# Altium project VESC_MotorController.PrjPcb
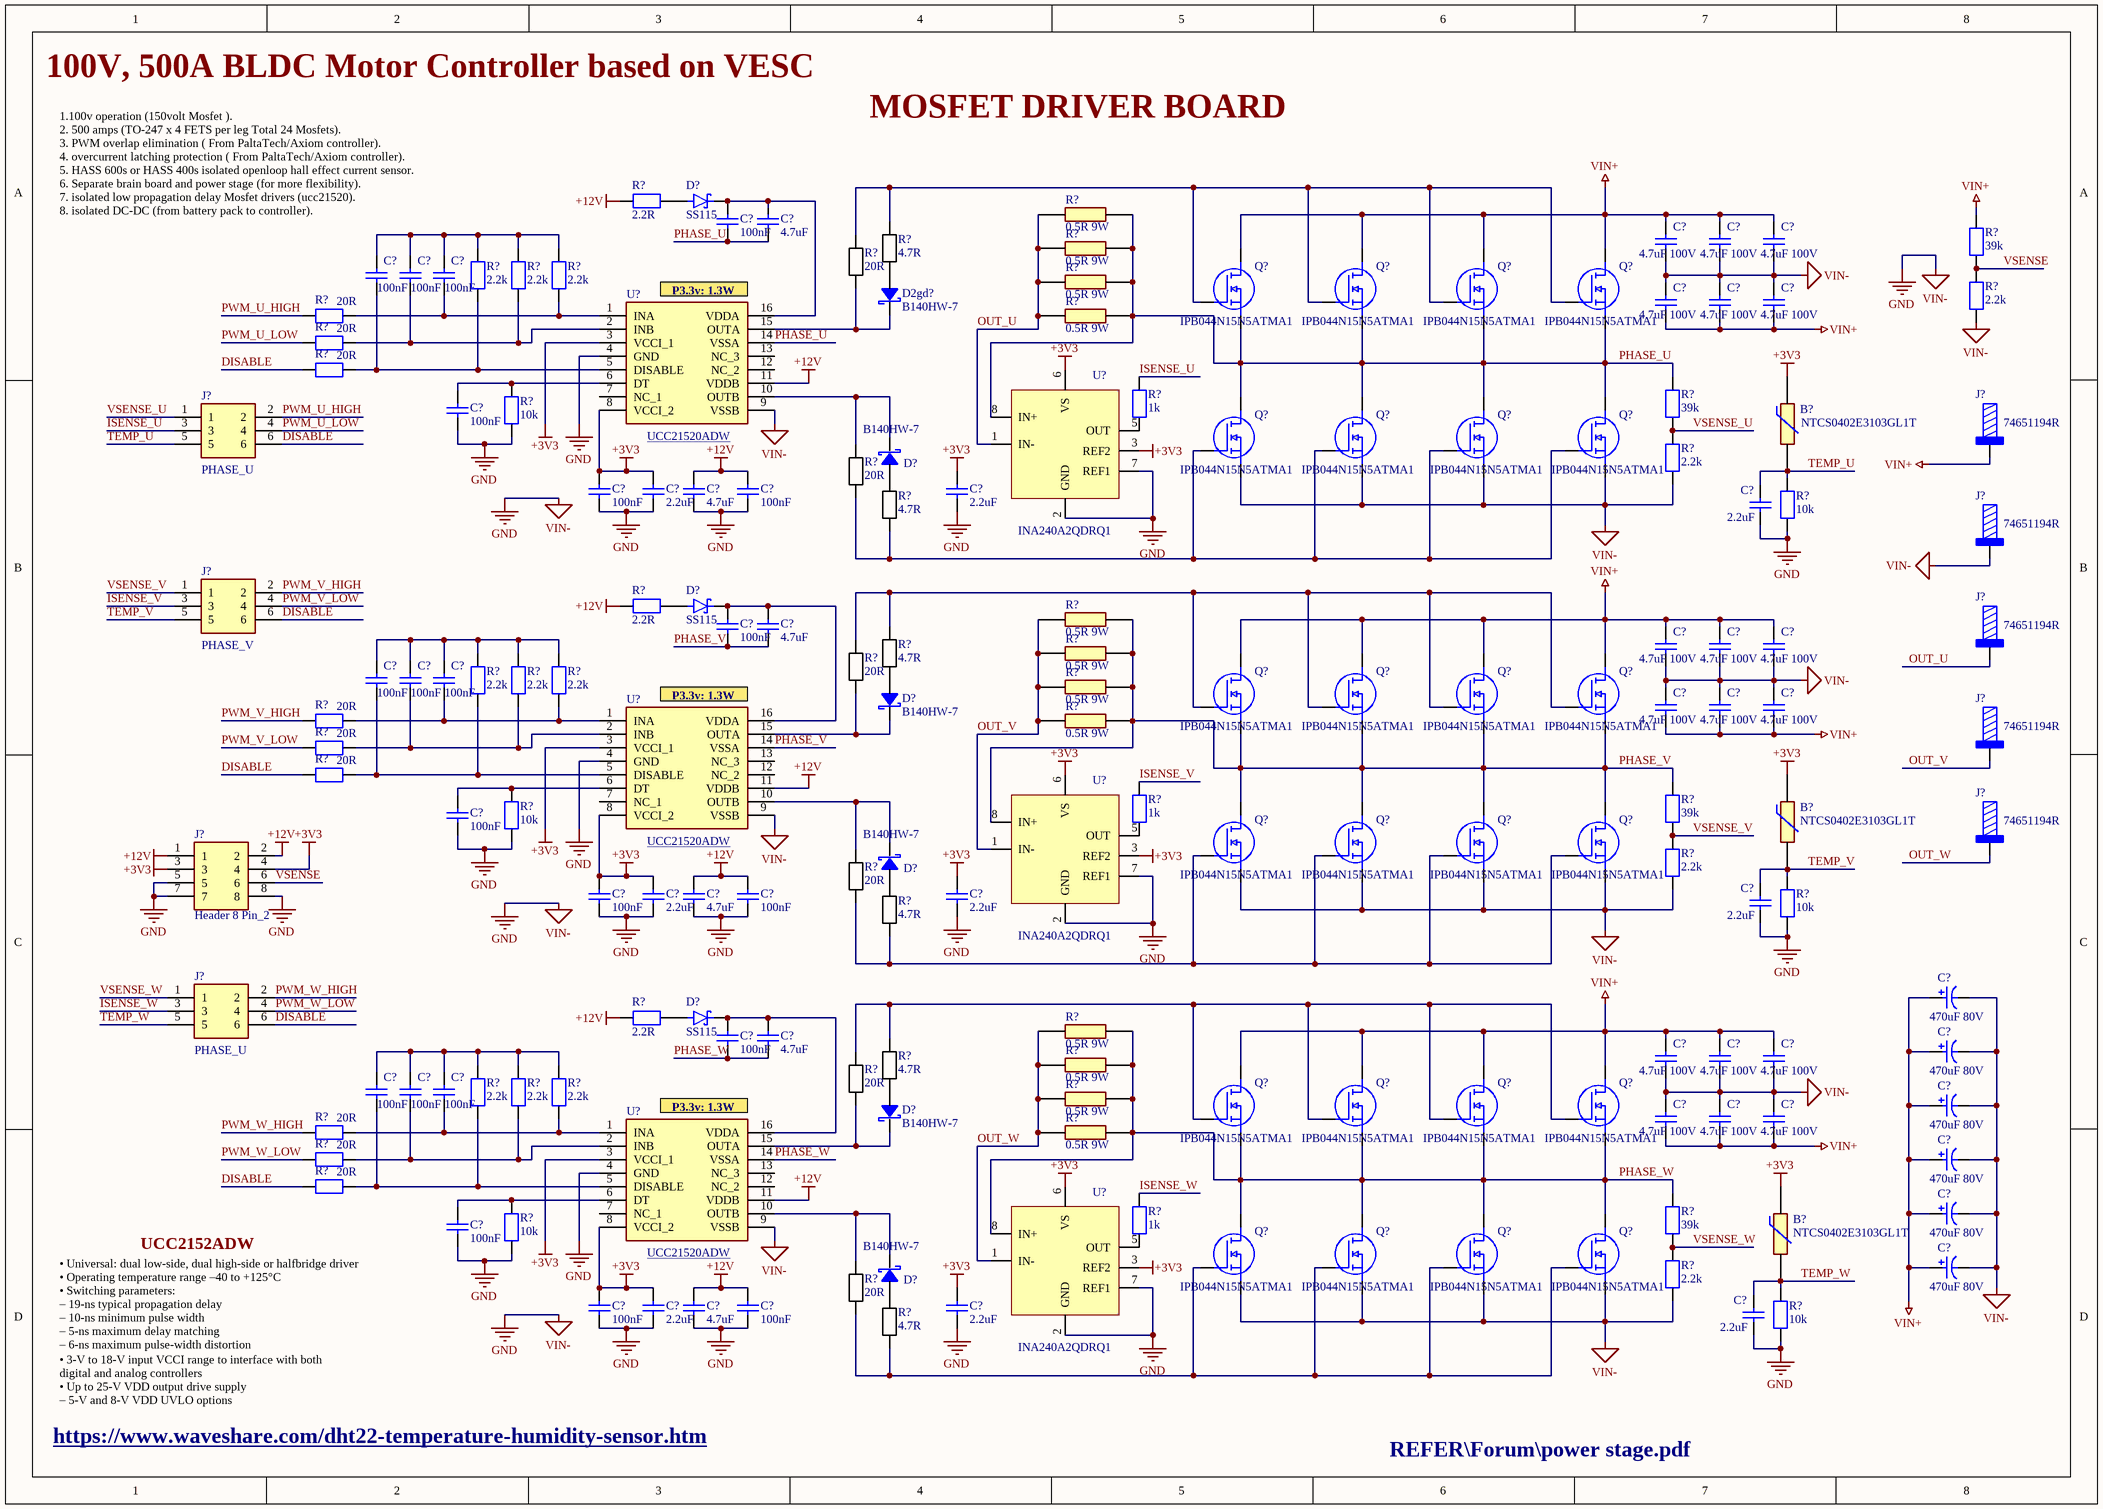
[diagram p0: PowerBoard.SchDoc]
2 sheets, 249 parts. Net scope: global (net labels, ports and power ports of the same name join across sheets).
Board files: Controller.PcbDoc, PowerBoard.PcbDoc
Sheets:
  PowerBoard.SchDoc
  Controller.SchDoc

## Sheet PowerBoard.SchDoc: DriveHUB CardFrame - Backplane Power
size A3; Date: 01/08/22; Engineer: AJC; DocumentNumber: 35-735; Revision: D; SheetNumber: 1; SheetTotal: 3; Manager: AJC

### Parts
(Parts that share a designator on the sheet are numbered #1, #2 ... from top to bottom, then left to right.)
B1  NTCS0402E3103GL1T  [THRMC1005X65N]
B2  NTCS0402E3103GL1T  [THRMC1005X65N]
B3  NTCS0402E3103GL1T  [THRMC1005X65N]
C?#1  100nF  [C0402]
C?#2  4.7uF  [C0603]
C?#3  4.7uF 100V  [CAPC6153X300N]
C?#4  4.7uF 100V  [CAPC6153X300N]
C?#5  4.7uF 100V  [CAPC6153X300N]
C?#6  100nF  [C0402]
C?#7  100nF  [C0402]
C?#8  100nF  [C0402]
C?#9  4.7uF 100V  [CAPC6153X300N]
C?#10  4.7uF 100V  [CAPC6153X300N]
C?#11  4.7uF 100V  [CAPC6153X300N]
C?#12  100nF  [C0402]
C?#13  100nF  [C0402]
C?#14  2.2uF  [C0603]
C?#15  4.7uF  [C0603]
C?#16  100nF  [C0402]
C?#17  2.2uF  [C0603]
C?#18  2.2uF  [C0603]
C?#19  100nF  [C0402]
C?#20  4.7uF  [C0603]
C?#21  4.7uF 100V  [CAPC6153X300N]
C?#22  4.7uF 100V  [CAPC6153X300N]
C?#23  4.7uF 100V  [CAPC6153X300N]
C?#24  100nF  [C0402]
C?#25  100nF  [C0402]
C?#26  100nF  [C0402]
C?#27  4.7uF 100V  [CAPC6153X300N]
C?#28  4.7uF 100V  [CAPC6153X300N]
C?#29  4.7uF 100V  [CAPC6153X300N]
C?#30  100nF  [C0402]
C?#31  100nF  [C0402]
C?#32  2.2uF  [C0603]
C?#33  4.7uF  [C0603]
C?#34  100nF  [C0402]
C?#35  2.2uF  [C0603]
C?#36  2.2uF  [C0603]
C?#37  470uF 80V  [CAPPRD500W80D1250H3200]
C?#38  100nF  [C0402]
C?#39  4.7uF  [C0603]
C?#40  470uF 80V  [CAPPRD500W80D1250H3200]
C?#41  4.7uF 100V  [CAPC6153X300N]
C?#42  4.7uF 100V  [CAPC6153X300N]
C?#43  4.7uF 100V  [CAPC6153X300N]
C?#44  100nF  [C0402]
C?#45  100nF  [C0402]
C?#46  100nF  [C0402]
C?#47  470uF 80V  [CAPPRD500W80D1250H3200]
C?#48  4.7uF 100V  [CAPC6153X300N]
C?#49  4.7uF 100V  [CAPC6153X300N]
C?#50  4.7uF 100V  [CAPC6153X300N]
C?#51  470uF 80V  [CAPPRD500W80D1250H3200]
C?#52  470uF 80V  [CAPPRD500W80D1250H3200]
C?#53  100nF  [C0402]
C?#54  470uF 80V  [CAPPRD500W80D1250H3200]
C?#55  100nF  [C0402]
C?#56  2.2uF  [C0603]
C?#57  4.7uF  [C0603]
C?#58  100nF  [C0402]
C?#59  2.2uF  [C0603]
C?#60  2.2uF  [C0603]
D2gd?  B140HW-7  [SOD123]
D?#1  SS115  [DIOM4325X250N]
D?#2  B140HW-7  [SOD123]
D?#3  SS115  [DIOM4325X250N]
D?#4  B140HW-7  [SOD123]
D?#5  B140HW-7  [SOD123]
D?#6  SS115  [DIOM4325X250N]
D?#7  B140HW-7  [SOD123]
D?#8  B140HW-7  [SOD123]
J?#1  74651194R  [74651194]
J?#2  PHASE_U  [61300621121]
J?#3  74651194R  [74651194]
J?#4  PHASE_V  [61300621121]
J?#5  74651194R  [74651194]
J?#6  74651194R  [74651194]
J?#7  74651194R  [74651194]
J?#8  Header 8 Pin_2  [61300821121]
J?#9  PHASE_U  [61300621121]
Q?#1  IPB044N15N5ATMA1  [IPB044N15N5ATMA1]
Q?#2  IPB044N15N5ATMA1  [IPB044N15N5ATMA1]
Q?#3  IPB044N15N5ATMA1  [IPB044N15N5ATMA1]
Q?#4  IPB044N15N5ATMA1  [IPB044N15N5ATMA1]
Q?#5  IPB044N15N5ATMA1  [IPB044N15N5ATMA1]
Q?#6  IPB044N15N5ATMA1  [IPB044N15N5ATMA1]
Q?#7  IPB044N15N5ATMA1  [IPB044N15N5ATMA1]
Q?#8  IPB044N15N5ATMA1  [IPB044N15N5ATMA1]
Q?#9  IPB044N15N5ATMA1  [IPB044N15N5ATMA1]
Q?#10  IPB044N15N5ATMA1  [IPB044N15N5ATMA1]
Q?#11  IPB044N15N5ATMA1  [IPB044N15N5ATMA1]
Q?#12  IPB044N15N5ATMA1  [IPB044N15N5ATMA1]
Q?#13  IPB044N15N5ATMA1  [IPB044N15N5ATMA1]
Q?#14  IPB044N15N5ATMA1  [IPB044N15N5ATMA1]
Q?#15  IPB044N15N5ATMA1  [IPB044N15N5ATMA1]
Q?#16  IPB044N15N5ATMA1  [IPB044N15N5ATMA1]
Q?#17  IPB044N15N5ATMA1  [IPB044N15N5ATMA1]
Q?#18  IPB044N15N5ATMA1  [IPB044N15N5ATMA1]
Q?#19  IPB044N15N5ATMA1  [IPB044N15N5ATMA1]
Q?#20  IPB044N15N5ATMA1  [IPB044N15N5ATMA1]
Q?#21  IPB044N15N5ATMA1  [IPB044N15N5ATMA1]
Q?#22  IPB044N15N5ATMA1  [IPB044N15N5ATMA1]
Q?#23  IPB044N15N5ATMA1  [IPB044N15N5ATMA1]
Q?#24  IPB044N15N5ATMA1  [IPB044N15N5ATMA1]
R3  0.5R 9W  [RESC10052X137N]
R6  0.5R 9W  [RESC10052X137N]
R11  0.5R 9W  [RESC10052X137N]
R14  0.5R 9W  [RESC10052X137N]
R26  0.5R 9W  [RESC10052X137N]
R28  0.5R 9W  [RESC10052X137N]
R33  0.5R 9W  [RESC10052X137N]
R35  0.5R 9W  [RESC10052X137N]
R47  0.5R 9W  [RESC10052X137N]
R49  0.5R 9W  [RESC10052X137N]
R54  0.5R 9W  [RESC10052X137N]
R56  0.5R 9W  [RESC10052X137N]
R?#1  2.2R  [R1206]
R?#2  4.7R  [R1206]
R?#3  20R  [R1206]
R?#4  39k  [R0805]
R?#5  2.2k  [R0603]
R?#6  2.2k  [R0603]
R?#7  2.2k  [R0603]
R?#8  2.2k  [R0805]
R?#9  20R  [R1206]
R?#10  20R  [R1206]
R?#11  20R  [R1206]
R?#12  1k  [R0603]
R?#13  39k  [R0805]
R?#14  10k  [R0603]
R?#15  20R  [R1206]
R?#16  2.2k  [R0805]
R?#17  4.7R  [R1206]
R?#18  10k  [R0603]
R?#19  2.2R  [R1206]
R?#20  4.7R  [R1206]
R?#21  20R  [R1206]
R?#22  2.2k  [R0603]
R?#23  2.2k  [R0603]
R?#24  2.2k  [R0603]
R?#25  20R  [R1206]
R?#26  20R  [R1206]
R?#27  20R  [R1206]
R?#28  1k  [R0603]
R?#29  39k  [R0805]
R?#30  10k  [R0603]
R?#31  20R  [R1206]
R?#32  2.2k  [R0805]
R?#33  4.7R  [R1206]
R?#34  10k  [R0603]
R?#35  2.2R  [R1206]
R?#36  4.7R  [R1206]
R?#37  20R  [R1206]
R?#38  2.2k  [R0603]
R?#39  2.2k  [R0603]
R?#40  2.2k  [R0603]
R?#41  20R  [R1206]
R?#42  20R  [R1206]
R?#43  20R  [R1206]
R?#44  1k  [R0603]
R?#45  39k  [R0805]
R?#46  10k  [R0603]
R?#47  20R  [R1206]
R?#48  2.2k  [R0805]
R?#49  4.7R  [R1206]
R?#50  10k  [R0603]
U?#1  UCC21520ADW  [SOIC127P1030X265-16N]
U?#2  INA240A2QDRQ1  [SOIC127P600X175-8N]
U?#3  UCC21520ADW  [SOIC127P1030X265-16N]
U?#4  INA240A2QDRQ1  [SOIC127P600X175-8N]
U?#5  UCC21520ADW  [SOIC127P1030X265-16N]
U?#6  INA240A2QDRQ1  [SOIC127P600X175-8N]

### Nets
+3V3: B1.1 B2.1 B3.1 C?#13.2 C?#14.2 C?#17.2 C?#31.2 C?#32.2 C?#35.2 C?#55.2 C?#56.2 C?#59.2 J?#8.3 J?#8.4 U?#1.3(VCCI_1) U?#1.8(VCCI_2) U?#2.3(REF2) U?#2.6(VS) U?#3.3(VCCI_1) U?#3.8(VCCI_2) U?#4.3(REF2) U?#4.6(VS) U?#5.3(VCCI_1) U?#5.8(VCCI_2) U?#6.3(REF2) U?#6.6(VS)
+12V: C?#15.2 C?#16.2 C?#33.2 C?#34.2 C?#57.2 C?#58.2 J?#8.1 J?#8.2 R?#1.1 R?#19.1 R?#35.1 U?#1.11(VDDB) U?#3.11(VDDB) U?#5.11(VDDB)
GND: C?#3.1 C?#4.1 C?#5.1 C?#9.2 C?#10.2 C?#11.2 C?#12.1 C?#13.1 C?#14.1 C?#15.1 C?#16.1 C?#17.1 C?#18.1 C?#21.1 C?#22.1 C?#23.1 C?#27.2 C?#28.2 C?#29.2 C?#30.1 C?#31.1 C?#32.1 C?#33.1 C?#34.1 C?#35.1 C?#36.1 C?#37.2 C?#40.2 C?#41.1 C?#42.1 C?#43.1 C?#47.2 C?#48.2 C?#49.2 C?#50.2 C?#51.2 C?#52.2 C?#53.1 C?#54.2 C?#55.1 C?#56.1 C?#57.1 C?#58.1 C?#59.1 C?#60.1 J?#3.1 J?#8.5 J?#8.7 J?#8.8 Q?#5.SOURCE Q?#6.SOURCE Q?#7.SOURCE Q?#8.SOURCE Q?#13.SOURCE Q?#14.SOURCE Q?#15.SOURCE Q?#16.SOURCE Q?#21.SOURCE Q?#22.SOURCE Q?#23.SOURCE Q?#24.SOURCE R?#8.1 R?#14.1 R?#16.1 R?#18.1 R?#30.1 R?#32.1 R?#34.1 R?#46.1 R?#48.1 R?#50.1 U?#1.4(GND) U?#1.9(VSSB) U?#2.2(GND) U?#2.7(REF1) U?#3.4(GND) U?#3.9(VSSB) U?#4.2(GND) U?#4.7(REF1) U?#5.4(GND) U?#5.9(VSSB) U?#6.2(GND) U?#6.7(REF1)  [also labelled VIN-]
VIN+: C?#3.2 C?#4.2 C?#5.2 C?#9.1 C?#10.1 C?#11.1 C?#21.2 C?#22.2 C?#23.2 C?#27.1 C?#28.1 C?#29.1 C?#37.1 C?#40.1 C?#41.2 C?#42.2 C?#43.2 C?#47.1 C?#48.1 C?#49.1 C?#50.1 C?#51.1 C?#52.1 C?#54.1 J?#1.1 Q?#1.DRAIN Q?#2.DRAIN Q?#3.DRAIN Q?#4.DRAIN Q?#9.DRAIN Q?#10.DRAIN Q?#11.DRAIN Q?#12.DRAIN Q?#17.DRAIN Q?#18.DRAIN Q?#19.DRAIN Q?#20.DRAIN R?#4.2
DISABLE: J?#2.6 J?#4.6 J?#9.6 R?#11.1 R?#27.1 R?#43.1
ISENSE_U: J?#2.3 R?#12.2
ISENSE_V: J?#4.3 R?#28.2
ISENSE_W: J?#9.3 R?#44.2
OUT_U: J?#5.1 R3.1 R6.1 R11.1 R14.1 U?#2.1(IN-)
OUT_V: J?#6.1 R26.1 R28.1 R33.1 R35.1 U?#4.1(IN-)
OUT_W: J?#7.1 R47.1 R49.1 R54.1 R56.1 U?#6.1(IN-)
PHASE_U: C?#1.1 C?#2.1 Q?#1.SOURCE Q?#2.SOURCE Q?#3.SOURCE Q?#4.SOURCE Q?#5.DRAIN Q?#6.DRAIN Q?#7.DRAIN Q?#8.DRAIN R3.2 R6.2 R11.2 R14.2 R?#13.2 U?#1.14(VSSA) U?#2.8(IN+)
PHASE_V: C?#19.1 C?#20.1 Q?#9.SOURCE Q?#10.SOURCE Q?#11.SOURCE Q?#12.SOURCE Q?#13.DRAIN Q?#14.DRAIN Q?#15.DRAIN Q?#16.DRAIN R26.2 R28.2 R33.2 R35.2 R?#29.2 U?#3.14(VSSA) U?#4.8(IN+)
PHASE_W: C?#38.1 C?#39.1 Q?#17.SOURCE Q?#18.SOURCE Q?#19.SOURCE Q?#20.SOURCE Q?#21.DRAIN Q?#22.DRAIN Q?#23.DRAIN Q?#24.DRAIN R47.2 R49.2 R54.2 R56.2 R?#45.2 U?#5.14(VSSA) U?#6.8(IN+)
PWM_U_HIGH: J?#2.2 R?#9.1
PWM_U_LOW: J?#2.4 R?#10.1
PWM_V_HIGH: J?#4.2 R?#25.1
PWM_V_LOW: J?#4.4 R?#26.1
PWM_W_HIGH: J?#9.2 R?#41.1
PWM_W_LOW: J?#9.4 R?#42.1
TEMP_U: B1.2 C?#18.2 J?#2.5 R?#18.2
TEMP_V: B2.2 C?#36.2 J?#4.5 R?#34.2
TEMP_W: B3.2 C?#60.2 J?#9.5 R?#50.2
VSENSE: J?#8.6 R?#4.1 R?#8.2
VSENSE_U: J?#2.1 R?#13.1 R?#16.2
VSENSE_V: J?#4.1 R?#29.1 R?#32.2
VSENSE_W: J?#9.1 R?#45.1 R?#48.2
NetC?#1_2: C?#1.2 C?#2.2 D?#1.C(K) U?#1.16(VDDA)
NetC?#6_1: C?#6.1 R?#5.1 R?#11.2 U?#1.5(DISABLE)
NetC?#6_2: C?#6.2 C?#7.2 C?#8.2 R?#5.2 R?#6.2 R?#7.2
NetC?#7_1: C?#7.1 R?#6.1 R?#10.2 U?#1.2(INB)
NetC?#8_1: C?#8.1 R?#7.1 R?#9.2 U?#1.1(INA)
NetC?#12_2: C?#12.2 R?#14.2 U?#1.6(DT)
NetC?#19_2: C?#19.2 C?#20.2 D?#3.C(K) U?#3.16(VDDA)
NetC?#24_1: C?#24.1 R?#22.1 R?#27.2 U?#3.5(DISABLE)
NetC?#24_2: C?#24.2 C?#25.2 C?#26.2 R?#22.2 R?#23.2 R?#24.2
NetC?#25_1: C?#25.1 R?#23.1 R?#26.2 U?#3.2(INB)
NetC?#26_1: C?#26.1 R?#24.1 R?#25.2 U?#3.1(INA)
NetC?#30_2: C?#30.2 R?#30.2 U?#3.6(DT)
NetC?#38_2: C?#38.2 C?#39.2 D?#6.C(K) U?#5.16(VDDA)
NetC?#44_1: C?#44.1 R?#38.1 R?#43.2 U?#5.5(DISABLE)
NetC?#44_2: C?#44.2 C?#45.2 C?#46.2 R?#38.2 R?#39.2 R?#40.2
NetC?#45_1: C?#45.1 R?#39.1 R?#42.2 U?#5.2(INB)
NetC?#46_1: C?#46.1 R?#40.1 R?#41.2 U?#5.1(INA)
NetC?#53_2: C?#53.2 R?#46.2 U?#5.6(DT)
NetD2gd?_A: D2gd?.A R?#2.1
NetD2gd?_C: D2gd?.C R?#3.1 U?#1.15(OUTA)
NetD?#1_A: D?#1.A R?#1.2
NetD?#2_A: D?#2.A R?#17.2
NetD?#2_C: D?#2.C R?#15.2 U?#1.10(OUTB)
NetD?#3_A: D?#3.A R?#19.2
NetD?#4_A: D?#4.A R?#20.1
NetD?#4_C: D?#4.C R?#21.1 U?#3.15(OUTA)
NetD?#5_A: D?#5.A R?#33.2
NetD?#5_C: D?#5.C R?#31.2 U?#3.10(OUTB)
NetD?#6_A: D?#6.A R?#35.2
NetD?#7_A: D?#7.A R?#36.1
NetD?#7_C: D?#7.C R?#37.1 U?#5.15(OUTA)
NetD?#8_A: D?#8.A R?#49.2
NetD?#8_C: D?#8.C R?#47.2 U?#5.10(OUTB)
NetQ?#1_GATE: Q?#1.GATE Q?#2.GATE Q?#3.GATE Q?#4.GATE R?#2.2 R?#3.2
NetQ?#5_GATE: Q?#5.GATE Q?#6.GATE Q?#7.GATE Q?#8.GATE R?#15.1 R?#17.1
NetQ?#9_GATE: Q?#9.GATE Q?#10.GATE Q?#11.GATE Q?#12.GATE R?#20.2 R?#21.2
NetQ?#13_GATE: Q?#13.GATE Q?#14.GATE Q?#15.GATE Q?#16.GATE R?#31.1 R?#33.1
NetQ?#17_GATE: Q?#17.GATE Q?#18.GATE Q?#19.GATE Q?#20.GATE R?#36.2 R?#37.2
NetQ?#21_GATE: Q?#21.GATE Q?#22.GATE Q?#23.GATE Q?#24.GATE R?#47.1 R?#49.1
NetR?#12_1: R?#12.1 U?#2.5(OUT)
NetR?#28_1: R?#28.1 U?#4.5(OUT)
NetR?#44_1: R?#44.1 U?#6.5(OUT)

Not connected (* = marked no-connect by the designer): U?#1 7(NC_1) 12(NC_2) 13(NC_3); U?#3 7(NC_1) 12(NC_2) 13(NC_3); U?#5 7(NC_1) 12(NC_2) 13(NC_3)

### Notes on the sheet
- 100V, 500A BLDC Motor Controller based on VESC
- MOSFET DRIVER BOARD
- 1.100v operation (150volt Mosfet ).
  2. 500 amps (TO-247 x 4 FETS per leg Total 24 Mosfets).
  3. PWM overlap elimination ( From PaltaTech/Axiom controller).
  4. overcurrent latching protection ( From PaltaTech/Axiom controller).
  5. HASS 600s or HASS 400s isolated openloop hall effect current sensor.
  6. Separate brain board and power stage (for more flexibility).
  7. isolated low propagation delay Mosfet drivers (ucc21520).
  8. isolated DC-DC (from battery pack to controller).
- (near U?#1) P3.3v: 1.3W
- (near U?#3) P3.3v: 1.3W
- (near U?#5) P3.3v: 1.3W
- UCC2152ADW
- • Universal: dual low-side, dual high-side or halfbridge driver
  • Operating temperature range –40 to +125°C
  • Switching parameters:
  – 19-ns typical propagation delay
  – 10-ns minimum pulse width
  – 5-ns maximum delay matching
  – 6-ns maximum pulse-width distortion
- https://www.waveshare.com/dht22-temperature-humidity-sensor.htm
- • 3-V to 18-V input VCCI range to interface with both
  digital and analog controllers
  • Up to 25-V VDD output drive supply
  – 5-V and 8-V VDD UVLO options
- REFER\Forum\power stage.pdf

### Library data of the parts
B1-B3 = NTCS0402E3103GL1T: NTC Thermistors 10Kohms 2% AEC-Q200; Manufacturer: Vishay; Supplier Part Number: 594-NTCS402E3103GL1T; Supplier: Mouser; Manufacturer Part Number: NTCS0402E3103GL1T; Price: 0.47; Value: NTCS0402E3103GL1T
C?#1 C?#6-C?#8 C?#12 C?#13 C?#16 C?#19 C?#24-C?#26 C?#30 C?#31 C?#34 C?#38 C?#44-C?#46 C?#53 C?#55 C?#58 = 100nF ± 10% 50V: Manufacturer: Yageo; Manufacturer Part Number: CS0603KRX7R9BB104; Value: 100nF; Supplier: mouser; Supplier Part Number: 603-CS0603KRX79BB104; Price: 0.1
C?#2 C?#15 C?#20 C?#33 C?#39 C?#57 = 4.7uF ± 10% 50V: Manufacturer: Yageo; Manufacturer Part Number: GRM188R61H225ME11J; Value: 4.7uF; Supplier: mouser; Supplier Part Number: 81-GRM188R61H225ME1J; Price: 0.3
C?#3-C?#5 C?#9-C?#11 C?#21-C?#23 C?#27-C?#29 C?#41-C?#43 C?#48-C?#50 = 4.7uF ± 10% 100V: Capacitor KRM55 L=6.1mm W=5.3mm T=2.8mm; Manufacturer: Murata Electronics; Manufacturer Part Number: KRM55LR72A475KH01K; Supplier Part Number: 81-KRM55LR72A475KH1K; Supplier: Mouser; Price: 3.2; Value: 4.7uF 100V
C?#14 C?#17 C?#18 C?#32 C?#35 C?#36 C?#56 C?#59 C?#60 = 2.2uF ± 10% 50V: Manufacturer: Yageo; Manufacturer Part Number: GRM188R61H225ME11J; Value: 2.2uF; Supplier: mouser; Supplier Part Number: 81-GRM188R61H225ME1J; Price: 0.3
C?#37 C?#40 C?#47 C?#51 C?#52 C?#54 = 470uF 80V 2200mA: Aluminum Electrolytic Capacitors - Radial Leaded 80VDC 470uF 2200mA Polar; Manufacturer: Panasonic; Manufacturer Part Number: EEU-FS1K471L; Supplier Part Number: 667-EEU-FS1K471L; Supplier: Mouser; Value: 470uF 80V; Price: 2
D2gd? D?#2 D?#4 D?#5 D?#7 D?#8 = B140HW-7: Schottky Diodes & Rectifiers 1A, 40V; Value: B140HW-7; Manufacturer Part Number: B140HW-7; Manufacturer: Diodes; Supplier: Mouser; Supplier Part Number: 621-B140HW-7; Price: 0.42
D?#1 D?#3 D?#6 = SS115: Schottky Diodes & Rectifiers 1A, 150V, Schottky Rectifier; Manufacturer: Taiwan Semiconductor; Value: 1A, 150V; Price: 0.34; Supplier: Mouser; Manufacturer Part Number: SS115; Supplier Part Number: 821-SS115
J?#1 J?#3 J?#5-J?#7 = 74651194R: WP-THRSH REDCUBE THR with external thread, M4 x 5mm, 85A; Manufacturer: Wurth Elektronik; Surface: Tin; ComponentLink1Description: Website Link; ComponentLink1URL: https://www.we-online.com/redexpert/article/74651194R?ad; ComponentLink2Description: Datasheet Link; ComponentLink2URL: https://www.we-online.com/redexpert/spec/74651194R?ad; Manufacturer Part Number: 74651194R; Category: REDCUBE THR; Match Code: WP-THRSH; Mount: Through Hole Reflow; Operating Temperature Max: 150°C; Operating Temperature Min: -55°C; Packaging: Tape and Reel; Length: 10mm; Width: 10mm; Height: 8.5mm; Material: Brass; Number of Pins: 9; Rated Current: 85A; Thread Length: 5mm; Thread Size: M4; Supplier: Mouser; Supplier Part Number: 710-74651195R; Price: 3.5; Value: 74651194R
J?#2 J?#4 J?#9 = Header 6 Pin_2: WR-PHD 2.54mm  Dual Pin Header THT 06p Wurth Elektronik WR-PHD Series, Series Number 6130, 2.54mm Pitch 6 Way 2 Row Straight PCB Header, Solder Termination; Value: 61300621121; Supplier Part Number: 710-61300621121; Supplier: Mouser; Manufacturer: Wurth Elektronik; Manufacturer Part Number: 61300621121; Price: 0.57
J?#8 = Header 8 Pin_2: Headers & Wire Housings WR-PHD 2.54mm Hdr 8P Dual Str Gold; Manufacturer: Wurth Elektronik; Value: 61300821121; Supplier Part Number: 710-61300621121; Supplier: Mouser; Manufacturer Part Number: 61300821121; Price: 0.7
Q?#1-Q?#24 = IPB044N15N5ATMA1: INFINEON - IPB044N15N5ATMA1 - Power MOSFET, N Channel, 150 V, 174 A, 0.0034 ohm, TO-263 (D2PAK), Surface Mount; Supplier Part Number: 726-IPB044N15N5ATMA1; Supplier: Mouser; Manufacturer: Infineon; Manufacturer Part Number: IPB044N15N5ATMA1; Price: 12.76; Value: IPB044N15N5ATMA1
R3 R6 R11 R14 R26 R28 R33 R35 R47 R49 R54 R56 = CSS2H-3920R-L500FE: Current Sense Resistors - SMD 0.5mOHMS 9W 1% AEC-Q200; Manufacturer: Bourns; Value: 0.5ohm 9W; Value: 2.2R; Supplier: Mouser; Supplier Part Number: 603-RC1206FR-072R2L; Price: 0.12
R?#1 R?#19 R?#35 = 2.2ohm 0.25W ±1%: 2.2 ohm 0.25W ±1%; Manufacturer Part Number: RC1206FR-072R2L; Manufacturer: Yageo; Supplier Part Number: 652-CSS2H3920RL500FE; Supplier: Mouser; Manufacturer Part Number: CSS2H-3920R-L500FE; Price: 2
R?#2 R?#17 R?#20 R?#33 R?#36 R?#49 = 4.7 ohm 0.25W ±1%: Manufacturer Part Number: RC1206FR-074R7L; Manufacturer: Yageo; Value: 4.7R; Supplier: Mouser; Supplier Part Number: 603-RC1206FR-074R7L; Price: 0.12
R?#3 R?#15 R?#21 R?#31 R?#37 R?#47 = 20 ohm 0.25W ±1%: Manufacturer Part Number: RC1206FR-0720RL; Manufacturer: Yageo; Value: 20R; Supplier: Mouser; Supplier Part Number: 603-RC1206FR-0720RL; Price: 0.12
R?#4 R?#13 R?#29 R?#45 = 39 kOhms ±1% 0.8W: Manufacturer: Yageo; Manufacturer Part Number: RT0805FRE0739KL; Value: 39k; Supplier: mouser; Supplier Part Number: 603-RT0805FRE0739KL; Price: 0.1
R?#5-R?#7 R?#22-R?#24 R?#38-R?#40 = 2.2 kOhms ±1% 0.1W: Manufacturer: Yageo; Manufacturer Part Number: RC0603FR-072K2L; Value: 2.2k; Supplier: Mouser; Supplier Part Number: 603-RC0603FR-072K2L; Price: 0.1
R?#8 R?#16 R?#32 R?#48 = 2.2 kOhms ±1% 0.8W: Manufacturer: Yageo; Manufacturer Part Number: RT0805FRE072K2L; Value: 2.2k; Supplier: mouser; Supplier Part Number: 603-RT0805FRE072K2L; Price: 0.1
R?#9-R?#11 R?#25-R?#27 R?#41-R?#43 = 20ohm 0.25W ±1%: 20 ohm 0.25W ±1%; Manufacturer Part Number: RC1206FR-0720RL; Manufacturer: Yageo; Value: 20R; Supplier: Mouser; Supplier Part Number: 603-RC1206FR-0720RL; Price: 0.12
R?#12 R?#28 R?#44 = 1 kOhms ±1% 0.1W: Manufacturer: Yageo; Manufacturer Part Number: RC0603FR-071KL; Value: 1k; Supplier: Mouser; Supplier Part Number: 603-RC0603FR-071KL; Price: 0.1
R?#14 R?#18 R?#30 R?#34 R?#46 R?#50 = 10 kOhms ±1% 0.1W: Manufacturer: Yageo; Manufacturer Part Number: RC0603FR-0710KL; Value: 10k; Supplier: mouser; Supplier Part Number: 603-RC0603FR-0710KL; Price: 0.1
U?#1 U?#3 U?#5 = UCC21520ADW: 4A/6A, 5.7 kVrms Isolated Dual Channel Gate Driver; Manufacturer: Texas Instruments; Supplier Part Number: 595-UCC21520ADW; Value: UCC21520ADW; Manufacturer Part Number: UCC21520ADW; Price: 7.6; Supplier: Mouser
U?#2 U?#4 U?#6 = INA240A2QDRQ1: Automotive, High/Low Side, Bi-Directional Zer-Drift Current Sense Amp w/ Enhanced PWM Rejection; Manufacturer: Texas Instruments; Supplier Part Number: 595-INA240A2QDRQ1; Supplier: Mouser; Manufacturer Part Number: INA240A2QDRQ1; Price: 3.8; Value: INA240A2QDRQ1

## Sheet Controller.SchDoc
size A3
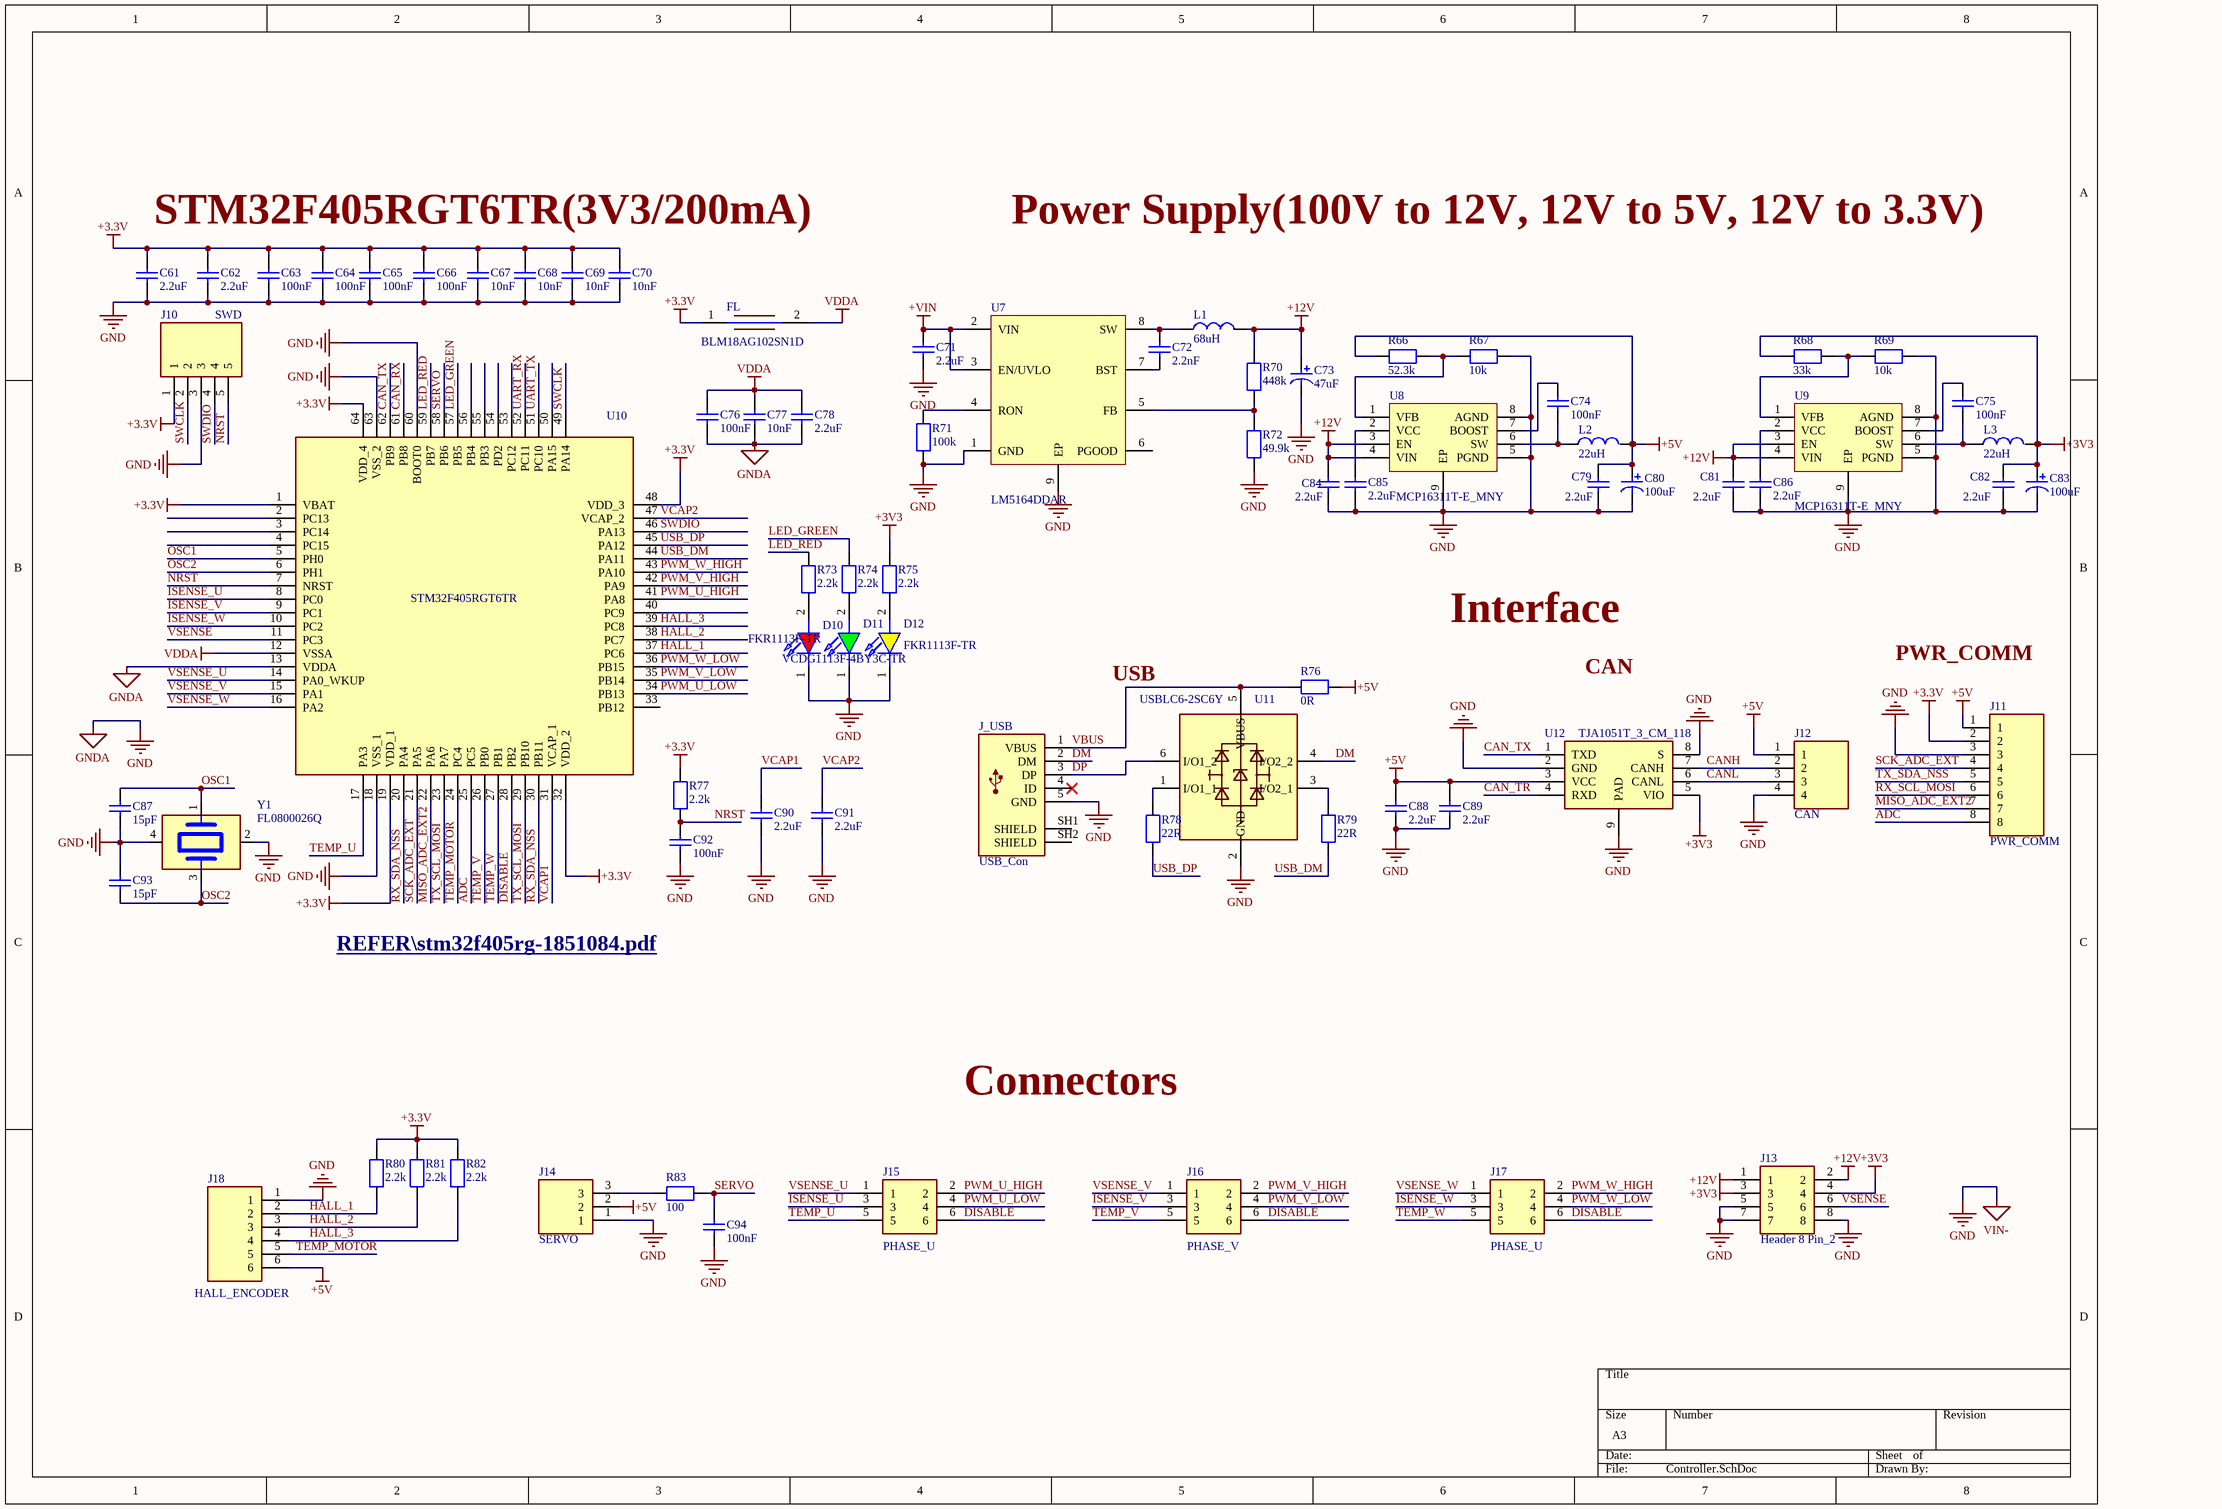
[diagram p1: Controller.SchDoc]

### Parts
C61  2.2uF  [C0603]
C62  2.2uF  [C0603]
C63  100nF  [C0402]
C64  100nF  [C0402]
C65  100nF  [C0402]
C66  100nF  [C0402]
C67  10nF  [C0402]
C68  10nF  [C0402]
C69  10nF  [C0402]
C70  10nF  [C0402]
C71  2.2uF  [C0603]
C72  2.2nF  [C0402]
C73  47uF  [CAPPRD200W52D500H1250]
C74  100nF  [C0402]
C75  100nF  [C0402]
C76  100nF  [C0402]
C77  10nF  [C0402]
C78  2.2uF  [C0603]
C79  2.2uF  [C0603]
C80  100uF  [CAPPRD225W50D680H1250]
C81  2.2uF  [C0603]
C82  2.2uF  [C0603]
C83  100uF  [CAPPRD225W50D680H1250]
C84  2.2uF  [C0603]
C85  2.2uF  [C0603]
C86  2.2uF  [C0603]
C87  15pF  [C0402]
C88  2.2uF  [C0603]
C89  2.2uF  [C0603]
C90  2.2uF  [C0603]
C91  2.2uF  [C0603]
C92  100nF  [C0402]
C93  15pF  [C0402]
C94  100nF  [C0402]
D10  FKR1113F-TR  [VCDG1113F4BY3CTR]
D11  VCDG1113F-4BY3C-TR  [VCDG1113F4BY3CTR]
D12  FKR1113F-TR  [VCDG1113F4BY3CTR]
FL  BLM18AG102SN1D  [BLM18EG121SH1D]
J10  SWD  [61300511121]
J11  PWR_COMM  [61301821121]
J12  CAN  [61300411121]
J13  Header 8 Pin_2  [61300821121]
J14  SERVO  [61300311121]
J15  PHASE_U  [61300621121]
J16  PHASE_V  [61300621121]
J17  PHASE_U  [61300621121]
J18  HALL_ENCODER  [61300611121]
J_USB  USB_Con  [10118194-0001LF]
L1  68uH  [INDPM7973X540N]
L2  22uH  [INDPM7973X540N]
L3  22uH  [INDPM7973X540N]
R66  52.3k  [R0603]
R67  10k  [R0603]
R68  33k  [R0603]
R69  10k  [R0603]
R70  448k  [R0603]
R71  100k  [R0603]
R72  49.9k  [R0603]
R73  2.2k  [R0603]
R74  2.2k  [R0603]
R75  2.2k  [R0603]
R76  0R  [R1206]
R77  2.2k  [R0603]
R78  22R  [R0603]
R79  22R  [R0603]
R80  2.2k  [R0603]
R81  2.2k  [R0603]
R82  2.2k  [R0603]
R83  100  [R0603]
U7  LM5164DDAR  [SOIC-8(EPAD)]
U8  MCP16311T-E_MNY  [MSOP-8]
U9  MCP16311T-E_MNY  [MSOP-8]
U10  STM32F405RGT6TR  [QFP50P1200X1200X160-64N]
U11  USBLC6-2SC6Y  [SOT95P280X145-6N]
U12  TJA1051T_3_CM_118  [SOIC127P600X175-8N]
Y1  FL0800026Q  [XTAL_FL0800026Q]

### Nets
+3.3V: C61.2 C62.2 C63.2 C64.2 C65.2 C66.2 C67.2 C68.2 C69.2 C70.2 FL.1 J10.1 J11.2 R77.2 R80.2 R81.2 R82.2 U10.1(VBAT) U10.19(VDD_1) U10.32(VDD_2) U10.48(VDD_3) U10.64(VDD_4)
+3V3: C82.2 C83.1 J13.3 J13.4 L3.2 R68.1 R75.2 U12.5(VIO)
+5V: C79.2 C80.1 C88.2 C89.2 J11.1 J12.1 J14.2 J18.6 L2.2 R66.1 R76.2 U12.3(VCC)
+12V: C73.1 C81.2 C84.2 J13.1 J13.2 L1.2 R70.2 U8.3(EN) U8.4(VIN) U9.3(EN) U9.4(VIN)
+VIN: C71.2 U7.2(VIN) U7.3(EN/UVLO)
GND: C61.1 C62.1 C63.1 C64.1 C65.1 C66.1 C67.1 C68.1 C69.1 C70.1 C71.1 C73.2 C76.1 C77.1 C78.1 C79.1 C80.2 C81.1 C82.1 C83.2 C84.1 C85.1 C86.1 C87.1 C88.1 C89.1 C90.1 C91.1 C92.1 C93.2 C94.1 D10.1(K) D11.1(K) D12.1(K) J10.3 J11.3 J12.4 J13.5 J13.7 J13.8 J14.1 J18.1 J_USB.5(GND) R67.2 R69.2 R71.1 R72.1 U7.1(GND) U7.9(EP) U8.5(PGND) U8.8(AGND) U8.9(EP) U9.5(PGND) U9.8(AGND) U9.9(EP) U10.13(VDDA) U10.18(VSS_1) U10.60(BOOT0) U10.63(VSS_2) U11.2(GND) U12.2(GND) U12.8(S) U12.9(PAD) Y1.2(GND) Y1.4(GND)  [also labelled GNDA, VIN-]
VDDA: C76.2 C77.2 C78.2 FL.2 U10.12(VSSA)
ADC: J11.8 U10.25(PC5)
CAN_RX: U10.61(PB8)
CAN_TR: U12.4(RXD)
CAN_TX: U10.62(PB9) U12.1(TXD)
CANH: J12.2 U12.7(CANH)
CANL: J12.3 U12.6(CANL)
DISABLE: J15.6 J16.6 J17.6 U10.28(PB2)
DM: J_USB.2(DM) U11.4(I/O2_2)
DP: J_USB.3(DP) U11.6(I/O1_2)
HALL_1: J18.2 R80.1 U10.37(PC6)
HALL_2: J18.3 R81.1 U10.38(PC7)
HALL_3: J18.4 R82.1 U10.39(PC8)
ISENSE_U: J15.3 U10.8(PC0)
ISENSE_V: J16.3 U10.9(PC1)
ISENSE_W: J17.3 U10.10(PC2)
LED_GREEN: R74.2 U10.57(PB5)
LED_RED: R73.2 U10.59(PB7)
MISO_ADC_EXT2: J11.7 U10.22(PA6)
NRST: C92.2 J10.5 R77.1 U10.7(NRST)
OSC1: C87.2 U10.5(PH0) Y1.1
OSC2: C93.1 U10.6(PH1) Y1.3
PWM_U_HIGH: J15.2 U10.41(PA8)
PWM_U_LOW: J15.4 U10.34(PB13)
PWM_V_HIGH: J16.2 U10.42(PA9)
PWM_V_LOW: J16.4 U10.35(PB14)
PWM_W_HIGH: J17.2 U10.43(PA10)
PWM_W_LOW: J17.4 U10.36(PB15)
RX_SCL_MOSI: J11.6
RX_SDA_NSS: U10.20(PA4) U10.30(PB11)
SCK_ADC_EXT: J11.4 U10.21(PA5)
SERVO: C94.2 R83.2 U10.58(PB6)
SWCLK: J10.2 U10.49(PA14)
SWDIO: J10.4 U10.46(PA13)
TEMP_MOTOR: J18.5 U10.24(PC4)
TEMP_U: J15.5 U10.17(PA3)
TEMP_V: J16.5 U10.26(PB0)
TEMP_W: J17.5 U10.27(PB1)
TX_SCL_MOSI: U10.23(PA7) U10.29(PB10)
TX_SDA_NSS: J11.5
UART_RX: U10.52(PC11)
UART_TX: U10.51(PC10)
USB_DM: R79.1 U10.44(PA11)
USB_DP: R78.1 U10.45(PA12)
VBUS: J_USB.1(VBUS) R76.1 U11.5(VBUS)
VCAP1: C90.2 U10.31(VCAP_1)
VCAP2: C91.2 U10.47(VCAP_2)
VSENSE: J13.6 U10.11(PC3)
VSENSE_U: J15.1 U10.14(PA0_WKUP)
VSENSE_V: J16.1 U10.15(PA1)
VSENSE_W: J17.1 U10.16(PA2)
NetC72_1: C72.1 U7.7(BST)
NetC72_2: C72.2 L1.1 U7.8(SW)
NetC74_1: C74.1 L2.1 U8.6(SW)
NetC74_2: C74.2 U8.7(BOOST)
NetC75_1: C75.1 L3.1 U9.6(SW)
NetC75_2: C75.2 U9.7(BOOST)
NetC85_2: C85.2 U8.2(VCC)
NetC86_2: C86.2 U9.2(VCC)
NetD10_2: D10.2(A) R73.1
NetD11_2: D11.2(A) R74.1
NetD12_2: D12.2(A) R75.1
NetJ14_3: J14.3 R83.1
NetR66_2: R66.2 R67.1 U8.1(VFB)
NetR68_2: R68.2 R69.1 U9.1(VFB)
NetR70_1: R70.1 R72.2 U7.5(FB)
NetR71_2: R71.2 U7.4(RON)
NetR78_2: R78.2 U11.1(I/O1_1)
NetR79_2: R79.2 U11.3(I/O2_1)

Not connected (* = marked no-connect by the designer): J_USB 4(ID)* SH1(SHIELD) SH2(SHIELD); U7 6(PGOOD); U10 2(PC13) 3(PC14) 4(PC15) 33(PB12) 40(PC9) 50(PA15) 53(PC12) 54(PD2) 55(PB3) 56(PB4)

### Notes on the sheet
- STM32F405RGT6TR(3V3/200mA)
- Power Supply(100V to 12V, 12V to 5V, 12V to 3.3V)
- Interface
- (near U11) USB
- CAN
- PWR_COMM
- REFER\stm32f405rg-1851084.pdf <F:\TASK\2023\8\VESC_MotorController\REFER\STM32f405rg-1851084.pdf>
- Connectors

### Library data of the parts
C61 C62 C71 C78 C79 C81 C82 C84-C86 C88-C91 = 2.2uF ± 10% 50V: as C?#14 on sheet PowerBoard; Value: 2.2uF; Supplier: mouser; Supplier Part Number: 81-GRM188R61H225ME1J; Price: 0.3
C63-C66 C74-C76 C92 C94 = 100nF ± 10% 50V: as C?#1 on sheet PowerBoard; Value: 100nF; Supplier: mouser; Supplier Part Number: 603-CS0603KRX79BB104; Price: 0.1
C67-C70 C77 = 10nF ± 10% 50V: Manufacturer: Yageo; Manufacturer Part Number: CS0603KRX79BB103; Value: 10nF; Supplier: mouser; Supplier Part Number: 603-CS0603KRX79BB103; Price: 0.1
C72 = 2.2nF ± 10% 50V: Manufacturer: Yageo; Manufacturer Part Number: CS0603KRX79BB222; Value: 2.2nF; Supplier: mouser; Supplier Part Number: 603-CS0603KRX79BB222; Price: 0.1
C73 = 47uF ± 10% 25V: Manufacturer: Wurth Electronic; Manufacturer Part Number: 860040472001; Value: 47uF; Supplier: mouser; Supplier Part Number: 710-860040472001; Price: 0.18
C80 C83 = 100uF ± 10% 25V: Manufacturer: Lelon; Manufacturer Part Number: RGA101M1EBK-0611G; Value: 100uF; Supplier: mouser; Supplier Part Number: 140-RGA101M1EBK0611G; Price: 0.17
C87 C93 = 15pF ± 10% 50V: Manufacturer: Yageo; Manufacturer Part Number: CS0603KRX79BB150; Value: 15pF; Supplier: mouser; Supplier Part Number: 603-CS0603KRX79BB150; Price: 0.1
D10 = LED_RED: R/A LED; Manufacturer: Stanley Electric; Value: Red; Supplier Part Number: 327-FKR1113FTR; Supplier: Mouser; Manufacturer Part Number: FKR1113F-TR; Price: 0.78
D11 = LED_GREEN: R/A LED; Manufacturer: Stanley Electric; Value: Green; Supplier Part Number: 327-VCDG1113F4BY3CTR; Supplier: Mouser; Manufacturer Part Number: VCDG1113F-4BY3C-TR; Price: 0.78
D12 = LED_YELLOW: R/A LED; Manufacturer: Stanley Electric; Manufacturer Part Number: FKY1113F-TR; Value: Yellow; Supplier Part Number: 327-FKY1113FTR; Supplier: Mouser; Price: 0.78
FL = BLM18AG102SN1D: Ferrite Beads 1000 OHM 25% Alternate Sizing Guide Below; Manufacturer: Murata; Manufacturer Part Number: BLM18AG102SN1D; Price: 0.15; Supplier Part Number: 81-BLM11A102S; Value: BLM18AG102SN1D; Supplier: Mouser
J10 = Header 5 Pin: Headers & Wire Housings WR-PHD 2.54mm Hdr 5P Single Str Gold; Manufacturer: Wurth Electronic; Value: 61300511121; Supplier Part Number: 710-61300511121; Supplier: Mouser; Manufacturer Part Number: 61300511121; Price: 0.37
J11 = Header 8 Pin: Headers & Wire Housings WR-PHD 2.54mm Hdr 8P Single Str Gold; Manufacturer: Wurth Electronic; Manufacturer Part Number: 61300811121; Value: 61300811121; Supplier Part Number: 710-61300811121; Supplier: Mouser; Price: 0.4
J12 = Header 4 Pin: Headers & Wire Housings WR-PHD 2.54mm Hdr 4P Single Str Gold; Manufacturer: Wurth Electronic; Value: 61300411121; Supplier Part Number: 710-61300411121; Supplier: Mouser; Manufacturer Part Number: 61300411121; Price: 0.27
J13 = Header 8 Pin_2: as J?#8 on sheet PowerBoard; Supplier Part Number: 710-61300621121; Supplier: Mouser; Manufacturer Part Number: 61300821121; Price: 0.7
J14 = Header 3 Pin: Headers & Wire Housings WR-PHD 2.54mm Hdr 3P Single Str Gold; Manufacturer: Wurth Electronic; Value: 61300311121; Supplier Part Number: 710-61300311121; Supplier: Mouser; Manufacturer Part Number: 61300311121; Price: 0.13
J15-J17 = Header 6 Pin_2: as J?#2 on sheet PowerBoard; Supplier Part Number: 710-61300621121; Supplier: Mouser; Manufacturer: Wurth Elektronik; Manufacturer Part Number: 61300621121; Price: 0.57
J18 = Header 6 Pin: Headers & Wire Housings WR-PHD 2.54mm Hdr 5P Single Str Gold; Manufacturer: Wurth Electronic; Value: 61300611121; Supplier Part Number: 710-61300611121; Supplier: Mouser; Manufacturer Part Number: 61300611121; Price: 0.35
J_USB = USB_Con: USB - micro B USB 2.0 Receptacle Connector 5 Position Through Hole; Manufacturer Part Number: 614105150721; Manufacturer: Wurth Electronics; Value: 614105150721; Price: 3; Supplier Part Number: 710-614105150721; Supplier: Mouser
L1 = SRP7050WA-680M: Ind,7.9x7.3x5.2mm,68uH+/-20%,2.7A,shd; Manufacturer: Bourns; Geometry.Height: 5.4mm; Supplier Part Number: 652-SRP7050WA-680M; Supplier: Mouser; Manufacturer Part Number: SRP7050WA-680M; Price: 1.46; Value: 68uH
L2 L3 = SRP7050WA-220M: Ind,7.9x7.3x5.2mm,22uH+/-20%,5A,shd; Manufacturer: Bourns; Supplier Part Number: 652-SRP7050WA-220M; Supplier: Mouser; Manufacturer Part Number: SRP7050WA-220M; Price: 1.46; Value: 22uH
R66 = 52.3 kOhms ±1% 0.1W: Manufacturer: Yageo; Manufacturer Part Number: RC0603FR-0752K3L; Value: 52.3k; Supplier: mouser; Supplier Part Number: 603-RC0603FR-0752K3L; Price: 0.1
R67 R69 = 10 kOhms ±1% 0.1W: as R?#14 on sheet PowerBoard; Value: 10k; Supplier: mouser; Supplier Part Number: 603-RC0603FR-0710KL; Price: 0.1
R68 = 33 kOhms ±1% 0.1W: Manufacturer: Yageo; Manufacturer Part Number: RC0603FR-0733KL; Value: 33k; Supplier: mouser; Supplier Part Number: 603-RC0603FR-0733KL; Price: 0.1
R70 = 448 kOhms ±1% 0.1W: Manufacturer: Yageo; Manufacturer Part Number: RC0603FR-07448KL; Value: 448k; Supplier: mouser; Supplier Part Number: 603-RC0603FR-07448KL; Price: 0.1
R71 = 100 kOhms ±1% 0.1W: Manufacturer: Yageo; Manufacturer Part Number: RC0603FR-07100KL; Value: 100k; Supplier: mouser; Supplier Part Number: 603-RC0603FR-07100KL; Price: 0.1
R72 = 49.9 kOhms ±1% 0.1W: Manufacturer: Yageo; Manufacturer Part Number: RC0603FR-0749K9L; Value: 49.9k; Supplier: mouser; Supplier Part Number: 603-RC0603FR-0749K9L; Price: 0.1
R73-R75 R77 R80-R82 = 2.2 kOhms ±1% 0.1W: as R?#5 on sheet PowerBoard; Value: 2.2k; Supplier: Mouser; Supplier Part Number: 603-RC0603FR-072K2L; Price: 0.1
R76 = 0ohm 0.25W ±1%: 0 ohm 0.25W ±1%; Manufacturer Part Number: RC1206FR-070RL; Manufacturer: Yageo; Value: 0R; Supplier Part Number: 603-RC1206FR-070RL
R78 R79 = 22ohm 0.1W ±1%: 22 ohm 0.1W ±1%; Manufacturer Part Number: RC0603FR-0722RL; Manufacturer: Yageo; Value: 22R; Supplier: Mouser; Supplier Part Number: 603-RC0603FR-0722RL; Price: 0.1
R83 = 100 Ohms ±1% 0.1W: Manufacturer: Yageo; Manufacturer Part Number: RC0603FR-0710KL; Value: 100; Supplier: mouser; Supplier Part Number: 603-RC0603FR-0710KL; Price: 0.1
U7 = LM5164DDAR: Texas Instruments 6-V to 100-V Input, 1-A Synchronous Buck DC-DC Converter With Ultra-Low IQ 8-SO PowerPAD -40 to 150; Value: 1.7mm; Supplier Part Number: 595-LM5164DDAR; Price: 3.5; Manufacturer: Texas Instruments; Manufacturer Part Number: LM5164DDAR; Supplier: Mouser
U8 U9 = MCP16311T-E_MNY: Microchip, MCP16311T-E/MNY Step Down DC-DC Converter 1A Adjustable, 2  24 V 8-Pin, TDFN; Supplier Part Number: 579-MCP16311T-E/MNY; Price: 1.8; Manufacturer: Microchip; Manufacturer Part Number: MCP16311T-E/MNY; Value: MCP16311T-E/MNY; Supplier: Mouser
U10 = STM32F405RGT6TR: STM32F405RGT6TR, 32 bit ARM Cortex M4 MCU 168MHz 1024 kB Flash, 192 kB RAM, 2xUSB CAN I2C 64-Pin LQFP; Manufacturer_Name: STMicroelectronics; Geometry.Height: 1.6mm; Mouser Part Number: 511-STM32F405RGT6TR; Mouser Price/Stock: https://www.mouser.co.uk/ProductDetail/STMicroelectronics/STM32F405RGT6TR?qs=MavH1QghrkHshpR6GkvPIg%3D%3D; Manufacturer_Part_Number: STM32F405RGT6TR; Datasheet Link: http://www.st.com/web/en/resource/technical/document/datasheet/DM00037051.pdf
U11 = USBLC6-2SC6Y: Low Cap. ESD Protection Auto SOT-23-6 STMicroelectronics USBLC6-2SC6Y, Dual Uni-Directional TVS Diode Array, 6-Pin SOT-23; Supplier Part Number: 511-USBLC6-2SC6Y; Supplier: Mouser; Manufacturer Part Number: USBLC6-2SC6Y; Price: 1.45; Manufacturer: STMicroelectronics; Value: USBLC6-2SC6Y
U12 = TJA1051T_3_CM_118: CAN Interface IC BL Advanced Automotive Analog; Manufacturer: NXP Semiconductors; Manufacturer Part Number: TJA1051T/3/CM,118; Value: TJA1051T/3/CM,118; Supplier Part Number: 771-TJA1051T/3CM118; Supplier: Mouser; Price: 1.6
Y1 = FL0800026Q: 8 MHz A±30ppm Crystals Crystal Ceramic SEAM3225 T&R 3K; Manufacturer: Diodes Incorporated; Value: 8MHz; Price: 0.5; Supplier: Mouser; Manufacturer Part Number: FL0800026Q; Supplier Part Number: 621-FL0800026Q

## Nets that join several sheets
+3V3: PowerBoard (26 pins), Controller (8 pins)
+12V: PowerBoard (14 pins), Controller (11 pins)
GND: PowerBoard (83 pins), Controller (65 pins)
DISABLE: PowerBoard (6 pins), Controller (J15.6 J16.6 J17.6 U10.28)
ISENSE_U: PowerBoard (J?#2.3 R?#12.2), Controller (J15.3 U10.8)
ISENSE_V: PowerBoard (J?#4.3 R?#28.2), Controller (J16.3 U10.9)
ISENSE_W: PowerBoard (J?#9.3 R?#44.2), Controller (J17.3 U10.10)
PWM_U_HIGH: PowerBoard (J?#2.2 R?#9.1), Controller (J15.2 U10.41)
PWM_U_LOW: PowerBoard (J?#2.4 R?#10.1), Controller (J15.4 U10.34)
PWM_V_HIGH: PowerBoard (J?#4.2 R?#25.1), Controller (J16.2 U10.42)
PWM_V_LOW: PowerBoard (J?#4.4 R?#26.1), Controller (J16.4 U10.35)
PWM_W_HIGH: PowerBoard (J?#9.2 R?#41.1), Controller (J17.2 U10.43)
PWM_W_LOW: PowerBoard (J?#9.4 R?#42.1), Controller (J17.4 U10.36)
TEMP_U: PowerBoard (B1.2 C?#18.2 J?#2.5 R?#18.2), Controller (J15.5 U10.17)
TEMP_V: PowerBoard (B2.2 C?#36.2 J?#4.5 R?#34.2), Controller (J16.5 U10.26)
TEMP_W: PowerBoard (B3.2 C?#60.2 J?#9.5 R?#50.2), Controller (J17.5 U10.27)
VSENSE: PowerBoard (J?#8.6 R?#4.1 R?#8.2), Controller (J13.6 U10.11)
VSENSE_U: PowerBoard (J?#2.1 R?#13.1 R?#16.2), Controller (J15.1 U10.14)
VSENSE_V: PowerBoard (J?#4.1 R?#29.1 R?#32.2), Controller (J16.1 U10.15)
VSENSE_W: PowerBoard (J?#9.1 R?#45.1 R?#48.2), Controller (J17.1 U10.16)

## Assembly variants
External Regulator Board: not fitted C28 C29 C30 C31 C32 C33 C34 C35 C36 C37 C38 C39 C40 C41 C42 C43 C44 C45 C46 C47 C48 C49 D2 D3 D4 D5 L1 L2 Q1 Q2 Q3 Q6 Q7 Q9 R40 R43 R44 R45 R46 R51 R52 R53 R54 R55 R56 R57 R59 R60 R63 R64 R65 R66 R67 R68 R69 R70 U7 U9
Onboard Regulators: all parts fitted